# EAGLE schematic LF_HF_ant (EAGLE 6.5.0)

## Sheet 1 of 2: LF Section
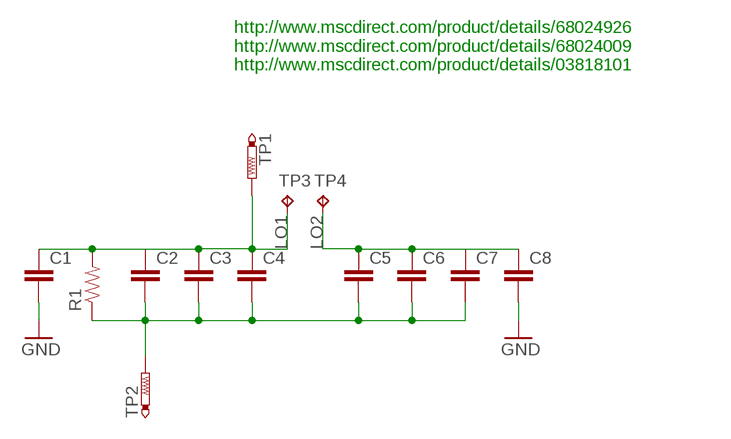
[diagram p0: schematic, sheet 1]

### Parts
C1  CAP1206  [1206]
C2  CAP1206  [1206]
C3  CAP1206  [1206]
C4  CAP1206  [1206]
C5  CAP1206  [1206]
C6  CAP1206  [1206]
C7  CAP1206  [1206]
C8  CAP1206  [1206]
R1  RESISTOR0603-RES  [0603-RES]
TP1  PTR1PAD1-17  [P1-17]
TP2  PTR1PAD1-17  [P1-17]
TP3  TP  [TP_MILLMAX_R]
TP4  TP  [TP_MILLMAX_R]

### Nets
GND: C1.2 C8.2 ; also sheet 2
LO1: C1.1 C2.1 C3.1 C4.1 R1.2 TP1.TP TP3.TP ; also sheet 2
LO2: C5.1 C6.1 C7.1 C8.1 TP4.TP ; also sheet 2
N$3: C2.2 C3.2 C4.2 C5.2 C6.2 C7.2 R1.1 TP2.TP

### Notes on the sheet
- http://www.mscdirect.com/product/details/68024926
  http://www.mscdirect.com/product/details/68024009
  http://www.mscdirect.com/product/details/03818101

## Sheet 2 of 2
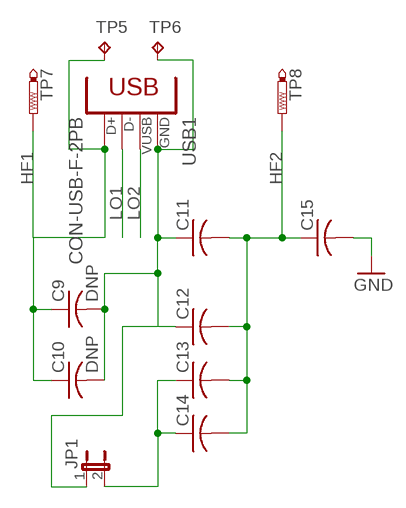
[diagram p1: schematic, sheet 2]

### Parts
C9  DNP  C-USC1206  [C1206]
C10  DNP  C-USC1206  [C1206]
C11  C-USC1206  [C1206]
C12  C-USC1206  [C1206]
C13  C-USC1206  [C1206]
C14  C-USC1206  [C1206]
C15  C-USC1206  [C1206]
JP1  JUMPER-2SMD-NO  [SJ_2S-NO]
TP5  TP  [TP_MILLMAX_R]
TP6  TP  [TP_MILLMAX_R]
TP7  PTR1PAD1-17  [P1-17]
TP8  PTR1PAD1-17  [P1-17]
USB1  CON-USB-F-2PB  [CONN_USB_A_F]

### Nets
GND: C15.2 ; also sheet 1
HF1: C9.1 C10.1 TP5.TP TP7.TP USB1.3(D+)
HF2: C11.2 C12.2 C13.2 C14.2 C15.1 TP8.TP
LO1: USB1.2(D-) ; also sheet 1
LO2: USB1.1(VUSB) ; also sheet 1
N$4: C9.2 C10.2 C11.1 C12.1 JP1.1 TP6.TP USB1.4(GND)
N$5: C13.1 C14.1 JP1.2
Unconnected: USB1.B1(BODY) USB1.B2(BODY)

## Library data of the parts
C1-C8 = SparkFun-Passives:CAP: Capacitor Standard 0603 ceramic capacitor, and 0.1" leaded capacitor.
C9-C15 = rcl:C-US: CAPACITOR, American symbol
JP1 = SparkFun-Passives:JUMPER-2: Jumper Basic 0.1" spaced jumper. Use with breakaway headers.
R1 = SparkFun-Passives:RESISTOR: Resistor Basic schematic elements and footprints for 0603, 1206, and PTH resistors.
TP1 TP2 TP7 TP8 = testpad:PTR1: TEST PIN
TP3-TP6 = testpad:TP: Test pad
USB1 = dp_devices:CON-USB-F-2PB: USB Female connector with 2 body pins